# EAGLE design sanguino_better (EAGLE 5.10)
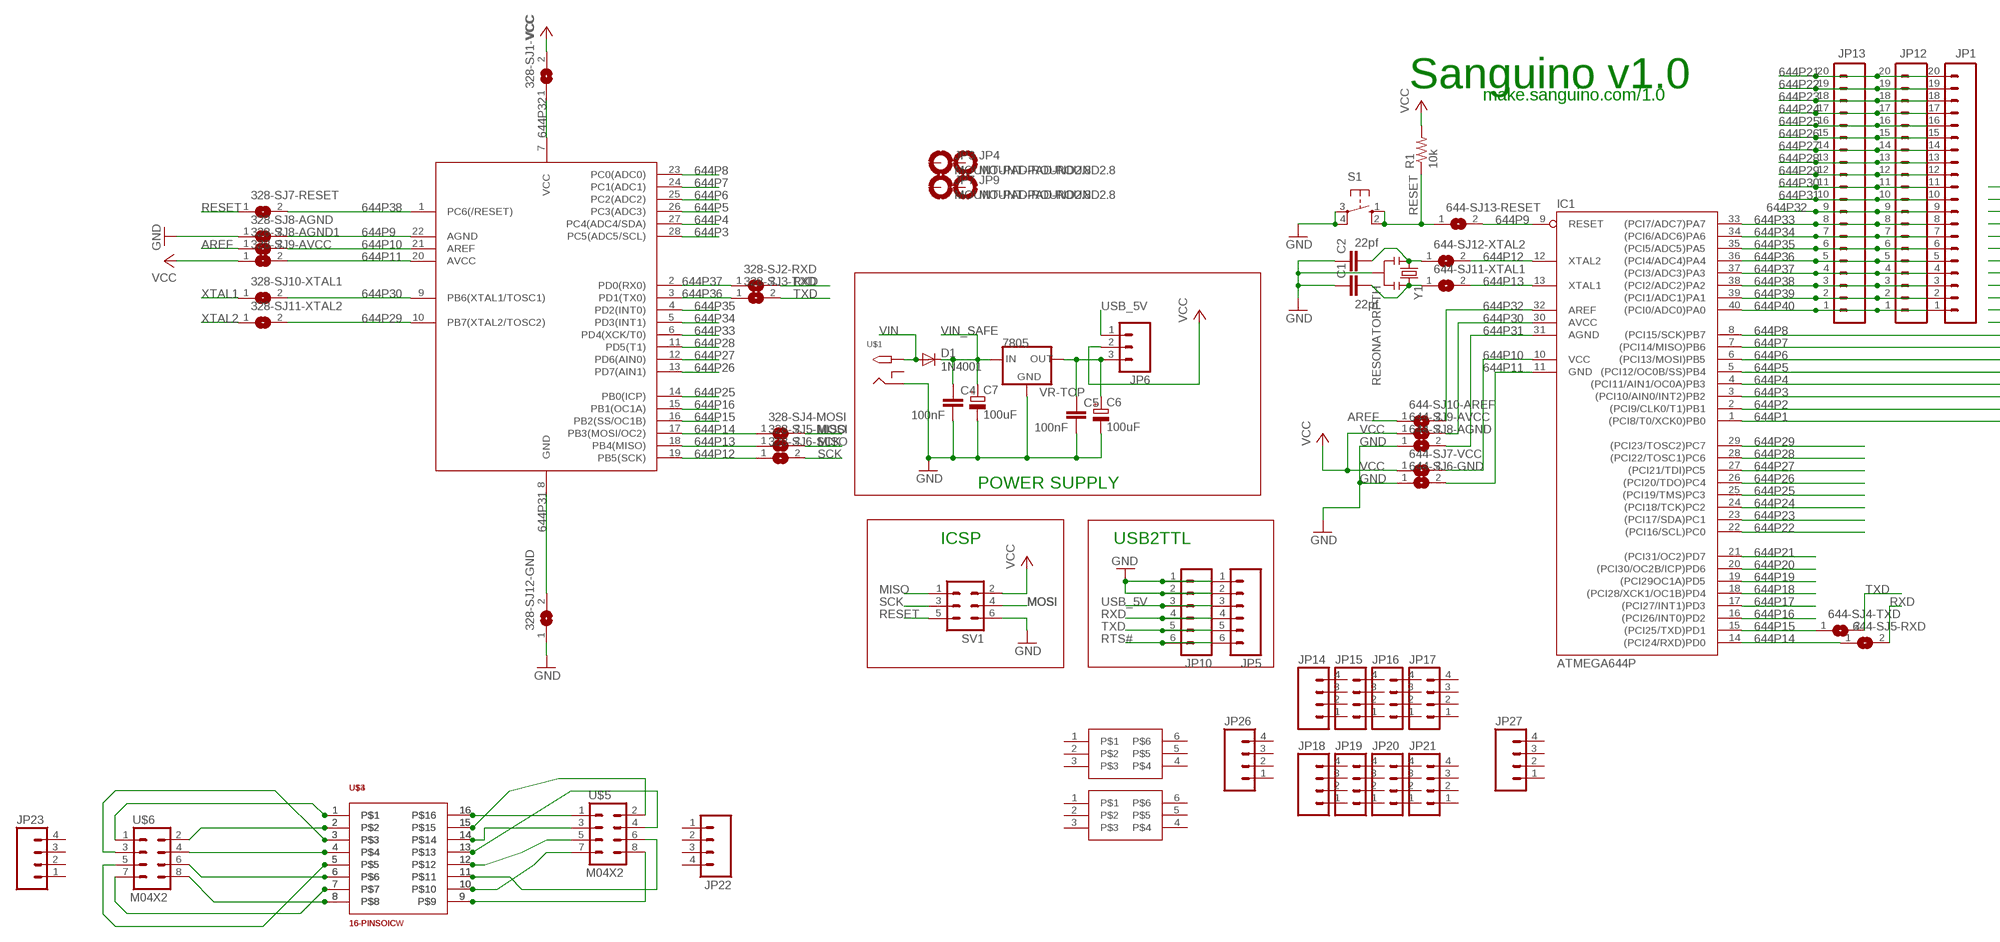
[diagram p0: schematic, sheet 1, part 1 of 2]
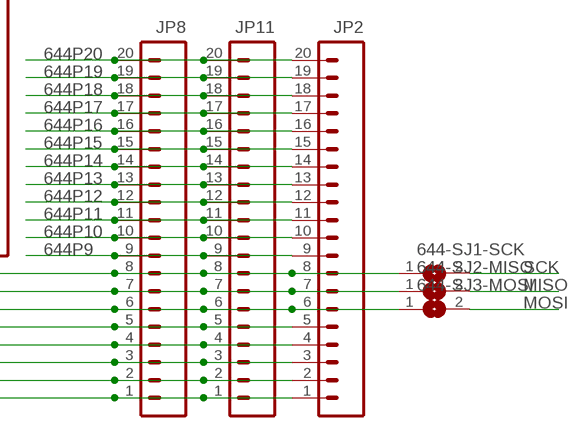
[diagram p1: schematic, sheet 1, part 2 of 2]

## Parts
328-SJ1-VCC  SJ  [SJ]
328-SJ2-RXD  SJ  [SJ]
328-SJ3-TXD  SJ  [SJ]
328-SJ4-MOSI  SJ  [SJ]
328-SJ5-MISO  SJ  [SJ]
328-SJ6-SCK  SJ  [SJ]
328-SJ7-RESET  SJ  [SJ]
328-SJ8-AGND  SJ  [SJ]
328-SJ8-AGND1  SJ  [SJ]
328-SJ9-AVCC  SJ  [SJ]
328-SJ10-XTAL1  SJ  [SJ]
328-SJ11-XTAL2  SJ  [SJ]
328-SJ12-GND  SJ  [SJ]
644-SJ1-SCK  SJ  [SJ]
644-SJ2-MISO  SJ  [SJ]
644-SJ3-MOSI  SJ  [SJ]
644-SJ4-TXD  SJ  [SJ]
644-SJ5-RXD  SJ  [SJ]
644-SJ6-GND  SJ  [SJ]
644-SJ7-VCC  SJ  [SJ]
644-SJ8-AGND  SJ  [SJ]
644-SJ9-AVCC  SJ  [SJ]
644-SJ10-AREF  SJ  [SJ]
644-SJ11-XTAL1  SJ  [SJ]
644-SJ12-XTAL2  SJ  [SJ]
644-SJ13-RESET  SJ  [SJ]
C1  22pf  C-EU025-025X050  [C025-025X050]
C2  22pf  C-EU025-025X050  [C025-025X050]
C4  100nF  C-EU050-030X075  [C050-030X075]
C5  100nF  C-EU050-030X075  [C050-030X075]
C6  100uF  CPOL-EUE2.5-6  [E2,5-6]
C7  100uF  CPOL-EUE2.5-6  [E2,5-6]
D1  1N4001  1N4004  [DO41-10]
IC1  ATMEGA644P  ATMEGA644V-10P  [DIL40]
JP1  M20  [1X20]
JP2  M20  [1X20]
JP3  MOUNT-PAD-ROUND2.8  [2,8-PAD]
JP4  MOUNT-PAD-ROUND2.8  [2,8-PAD]
JP5  M06LOCK  [1X06_LOCK]
JP6  M03PTH  [1X03]
JP7  MOUNT-PAD-ROUND2.8  [2,8-PAD]
JP8  M20  [1X20]
JP9  MOUNT-PAD-ROUND2.8  [2,8-PAD]
JP10  M06SIP  [1X06]
JP11  M20  [1X20]
JP12  M20  [1X20]
JP13  M20  [1X20]
JP14  M04PTH  [1X04]
JP15  M04PTH  [1X04]
JP16  M04PTH  [1X04]
JP17  M04PTH  [1X04]
JP18  M04PTH  [1X04]
JP19  M04PTH  [1X04]
JP20  M04PTH  [1X04]
JP21  M04PTH  [1X04]
JP22  M04PTH  [1X04]
JP23  M04PTH  [1X04]
JP26  M04PTH  [1X04]
JP27  M04PTH  [1X04]
R1  10k  R-US_0207/2V  [0207/2V]
S1  10-XX  [B3F-10XX]
SV1  ML6  [ML6]
U$1  2.1MMJACKTHM  [PJ-102A-DOUBLE_SIDED]
U$2  ATMEGA328P  [DIL28-3]
U$3  16-PINSOICW  [SO16W]
U$4  16-PINSOIC  [SO16]
U$5  M04X2  [2X4]
U$6  M04X2  [2X4]
U$7  6-PINSOT23-6  [SOT23-6L]
U$8  6-PINSC70-6  [SC70-6L]
VR-TOP  7805  V_REG_78XXSINK  [TO220-IGO]
Y1  RESONATORPTH  [RESONATOR-PTH]

## Nets
644P1: IC1.1((PCI8/T0/XCK0)PB0) JP2.1 JP8.1 JP11.1
644P2: IC1.2((PCI9/CLK0/T1)PB1) JP2.2 JP8.2 JP11.2
644P3: IC1.3((PCI10/AIN0/INT2)PB2) JP2.3 JP8.3 JP11.3 U$2.28(PC5(ADC5/SCL))
644P4: IC1.4((PCI11/AIN1/OC0A)PB3) JP2.4 JP8.4 JP11.4 U$2.27(PC4(ADC4/SDA))
644P5: IC1.5((PCI12/OC0B/SS)PB4) JP2.5 JP8.5 JP11.5 U$2.26(PC3(ADC3))
644P6: 644-SJ3-MOSI.1 IC1.6((PCI13/MOSI)PB5) JP2.6 JP8.6 JP11.6 U$2.25(PC2(ADC2))
644P7: 644-SJ2-MISO.1 IC1.7((PCI14/MISO)PB6) JP2.7 JP8.7 JP11.7 U$2.24(PC1(ADC1))
644P8: 644-SJ1-SCK.1 IC1.8((PCI15/SCK)PB7) JP2.8 JP8.8 JP11.8 U$2.23(PC0(ADC0))
644P9: 328-SJ8-AGND.2 644-SJ13-RESET.2 IC1.9(RESET) JP2.9 JP8.9 JP11.9 U$2.22(AGND)
644P10: 328-SJ8-AGND1.2 644-SJ7-VCC.2 IC1.10(VCC) JP2.10 JP8.10 JP11.10 U$2.21(AREF)
644P11 [power]: 328-SJ9-AVCC.2 644-SJ6-GND.2 IC1.11(GND) JP2.11 JP8.11 JP11.11 U$2.20(AVCC)
644P12: 328-SJ6-SCK.1 644-SJ12-XTAL2.2 IC1.12(XTAL2) JP2.12 JP8.12 JP11.12 U$2.19(PB5(SCK))
644P13: 328-SJ5-MISO.1 644-SJ11-XTAL1.2 IC1.13(XTAL1) JP2.13 JP8.13 JP11.13 U$2.18(PB4(MISO))
644P14: 328-SJ4-MOSI.1 644-SJ5-RXD.1 IC1.14((PCI24/RXD)PD0) JP2.14 JP8.14 JP11.14 U$2.17(PB3(MOSI/OC2))
644P15: 644-SJ4-TXD.1 IC1.15((PCI25/TXD)PD1) JP2.15 JP8.15 JP11.15 U$2.16(PB2(SS/OC1B))
644P16: IC1.16((PCI26/INT0)PD2) JP2.16 JP8.16 JP11.16 U$2.15(PB1(OC1A))
644P17: IC1.17((PCI27/INT1)PD3) JP2.17 JP8.17 JP11.17
644P18: IC1.18((PCI28/XCK1/OC1B)PD4) JP2.18 JP8.18 JP11.18
644P19: IC1.19((PCI29OC1A)PD5) JP2.19 JP8.19 JP11.19
644P20: IC1.20((PCI30/OC2B/ICP)PD6) JP2.20 JP8.20 JP11.20
644P21: IC1.21((PCI31/OC2)PD7) JP1.20 JP12.20 JP13.20
644P22: IC1.22((PCI16/SCL)PC0) JP1.19 JP12.19 JP13.19
644P23: IC1.23((PCI17/SDA)PC1) JP1.18 JP12.18 JP13.18
644P24: IC1.24((PCI18/TCK)PC2) JP1.17 JP12.17 JP13.17
644P25: IC1.25((PCI19/TMS)PC3) JP1.16 JP12.16 JP13.16 U$2.14(PB0(ICP))
644P26: IC1.26((PCI20/TDO)PC4) JP1.15 JP12.15 JP13.15 U$2.13(PD7(AIN1))
644P27: IC1.27((PCI21/TDI)PC5) JP1.14 JP12.14 JP13.14 U$2.12(PD6(AIN0))
644P28: IC1.28((PCI22/TOSC1)PC6) JP1.13 JP12.13 JP13.13 U$2.11(PD5(T1))
644P29: 328-SJ11-XTAL2.2 IC1.29((PCI23/TOSC2)PC7) JP1.12 JP12.12 JP13.12 U$2.10(PB7(XTAL2/TOSC2))
644P30: 328-SJ10-XTAL1.2 644-SJ9-AVCC.2 IC1.30(AVCC) JP1.11 JP12.11 JP13.11 U$2.9(PB6(XTAL1/TOSC1))
644P31: 328-SJ12-GND.2 644-SJ8-AGND.2 IC1.31(AGND) JP1.10 JP12.10 JP13.10 U$2.8(GND)
644P32: 328-SJ1-VCC.1 644-SJ10-AREF.2 IC1.32(AREF) JP1.9 JP12.9 JP13.9 U$2.7(VCC)
644P33: IC1.33((PCI7/ADC7)PA7) JP1.8 JP12.8 JP13.8 U$2.6(PD4(XCK/T0))
644P34: IC1.34((PCI6/ADC6)PA6) JP1.7 JP12.7 JP13.7 U$2.5(PD3(INT1))
644P35: IC1.35((PCI5/ADC5)PA5) JP1.6 JP12.6 JP13.6 U$2.4(PD2(INT0))
644P36: 328-SJ3-TXD.1 IC1.36((PCI4/ADC4)PA4) JP1.5 JP12.5 JP13.5 U$2.3(PD1(TX0))
644P37: 328-SJ2-RXD.1 IC1.37((PCI3/ADC3)PA3) JP1.4 JP12.4 JP13.4 U$2.2(PD0(RX0))
644P38: 328-SJ7-RESET.2 IC1.38((PCI2/ADC2)PA2) JP1.3 JP12.3 JP13.3 U$2.1(PC6(/RESET))
644P39: IC1.39((PCI1/ADC1)PA1) JP1.2 JP12.2 JP13.2
644P40: IC1.40((PCI0/ADC0)PA0) JP1.1 JP12.1 JP13.1
AREF: 328-SJ8-AGND1.1 644-SJ10-AREF.1
GND: 328-SJ8-AGND.1 328-SJ12-GND.1 644-SJ6-GND.1 644-SJ8-AGND.1 C1.1 C2.1 C4.2 C5.2 C6.- C7.- JP5.1 JP5.2 JP10.1 JP10.2 S1.3(P) S1.4(P1) SV1.6 U$1.RING VR-TOP.GND Y1.2
MISO: 328-SJ5-MISO.2 644-SJ2-MISO.2 SV1.1
MOSI: 328-SJ4-MOSI.2 644-SJ3-MOSI.2 SV1.4
N$11: U$3.16 U$4.16 U$5.1
N$12: U$3.15 U$4.15 U$5.2
N$14: U$3.5 U$4.5 U$6.5
N$15: U$3.1 U$4.1 U$6.1
N$21: U$3.14 U$4.14 U$5.3
N$22: U$3.13 U$4.13 U$5.4
N$23: U$3.12 U$4.12 U$5.5
N$24: U$3.11 U$4.11 U$5.6
N$25: U$3.10 U$4.10 U$5.7
N$26: U$3.9 U$4.9 U$5.8
N$27: U$3.8 U$4.8 U$6.8
N$28: U$3.7 U$4.7 U$6.7
N$29: U$3.6 U$4.6 U$6.6
N$31: U$3.4 U$4.4 U$6.4
N$32: U$3.3 U$4.3 U$6.3
N$33: U$3.2 U$4.2 U$6.2
RESET: 328-SJ7-RESET.1 644-SJ13-RESET.1 R1.1 S1.1(S) S1.2(S1) SV1.5
RTS#: JP5.6 JP10.6
RXD: 328-SJ2-RXD.2 644-SJ5-RXD.2 JP5.4 JP10.4
SCK: 328-SJ6-SCK.2 644-SJ1-SCK.2 SV1.3
TXD: 328-SJ3-TXD.2 644-SJ4-TXD.2 JP5.5 JP10.5
USB_5V: JP5.3 JP6.1 JP10.3
VCC [power]: 328-SJ1-VCC.2 328-SJ9-AVCC.1 644-SJ7-VCC.1 644-SJ9-AVCC.1 JP6.2 R1.2 SV1.2
VIN [power]: D1.A U$1.TIP
VIN_SAFE [power]: C4.1 C7.+ D1.C VR-TOP.IN
VREG-OUT: C5.1 C6.+ JP6.3 VR-TOP.OUT
XTAL1: 328-SJ10-XTAL1.1 644-SJ11-XTAL1.1 C1.2 Y1.3
XTAL2: 328-SJ11-XTAL2.1 644-SJ12-XTAL2.1 C2.2 Y1.1
Unconnected: JP3.B2,8(MOUNT) JP4.B2,8(MOUNT) JP7.B2,8(MOUNT) JP9.B2,8(MOUNT) JP14.1 JP14.2 JP14.3 JP14.4 JP15.1 JP15.2 JP15.3 JP15.4 JP16.1 JP16.2 JP16.3 JP16.4 JP17.1 JP17.2 JP17.3 JP17.4 JP18.1 JP18.2 JP18.3 JP18.4 JP19.1 JP19.2 JP19.3 JP19.4 JP20.1 JP20.2 JP20.3 JP20.4 JP21.1 JP21.2 JP21.3 JP21.4 JP22.1 JP22.2 JP22.3 JP22.4 JP23.1 JP23.2 JP23.3 JP23.4 JP26.1 JP26.2 JP26.3 JP26.4 JP27.1 JP27.2 JP27.3 JP27.4 U$1.RING_SW U$7.1 U$7.2 U$7.3 U$7.4 U$7.5 U$7.6 U$8.1 U$8.2 U$8.3 U$8.4 U$8.5 U$8.6

## Notes on the sheet
- Sanguino v1.0
- make.sanguino.com/1.0
- POWER SUPPLY
- ICSP | USB2TTL

## Library data of the parts
328-SJ1-VCC 328-SJ2-RXD 328-SJ3-TXD 328-SJ4-MOSI 328-SJ5-MISO 328-SJ6-SCK 328-SJ7-RESET 328-SJ8-AGND 328-SJ8-AGND1 328-SJ9-AVCC 328-SJ10-XTAL1 328-SJ11-XTAL2 328-SJ12-GND 644-SJ1-SCK 644-SJ2-MISO 644-SJ3-MOSI 644-SJ4-TXD 644-SJ5-RXD 644-SJ6-GND 644-SJ7-VCC 644-SJ8-AGND 644-SJ9-AVCC 644-SJ10-AREF 644-SJ11-XTAL1 644-SJ12-XTAL2 644-SJ13-RESET = ideabot:SJ: SMD solder JUMPER
C1 C2 C4 C5 = rcl:C-EU: CAPACITOR, European symbol
C6 C7 = rcl:CPOL-EU: POLARIZED CAPACITOR, European symbol
D1 = diode:1N4004: DIODE general purpose rectifier, 1 A
IC1 = avr:ATMEGA644*P: MICROCONTROLLER 64 kBytes FLASH 4 kBytes SRAM 2 kBytes EEPROM DUAL USART 8-channel 10 bit ADC
JP1 JP2 JP8 JP11-JP13 = SparkFun:M20: This is just like the LOCK variant in that the holes are staggared by 5 mil, but except for the last two holes. They are not altered from the "standard" footprint layout. This is used for a special purpose on the layout of our Graphic LCD Backpack. Make sure you want to use this device before selecting it for you project!
JP3 JP4 JP7 JP9 = holes:MOUNT-PAD-ROUND: MOUNTING PAD, round
JP5 JP10 = SparkFun:M06: Header 6 Standard 6-pin 0.1" header. Use with straight break away headers (SKU : PRT-00116), right angle break away headers (PRT-00553), swiss pins (PRT-00743), machine pins (PRT-00117), and female headers (PRT-00115). Molex polarized connector foot print use with SKU : PRT-08094 with associated crimp pins and housings. NOTES ON THE VARIANTS LOCK and LOCK_LONGPADS... This footprint was designed to help hold the alignment of a through-hole component (i.e. 6-pin header) while soldering it into place. You may notice that each hole has been shifted either up or down by 0.005 of an inch from it's more standard position (which is a perfectly straight line). This slight alteration caused the pins (the squares in the middle) to touch the edges of the holes. Because they are alternating, it causes a "brace" to hold the component in place. 0.005 has proven to be the perfect amount of "off-center" position when using our standard breakaway headers. Although looks a little odd when you look at the bare footprint, once you have a header in there, the alteration is very hard to notice. Also, if you push a header all the way into place, it is covered up entirely on the bottom side. This idea of altering the position of holes to aid alignment will be further integrated into the Sparkfun Library for other footprints. It can help hold any component with 3 or more connection pins.
JP6 = SparkFun:M03: Header 3 Standard 3-pin 0.1" header. Use with straight break away headers (SKU : PRT-00116), right angle break away headers (PRT-00553), swiss pins (PRT-00743), machine pins (PRT-00117), and female headers (PRT-00115). Molex polarized connector foot print use with SKU : PRT-08232 with associated crimp pins and housings.
JP14-JP23 JP26 JP27 = SparkFun:M04: Header 4 Standard 4-pin 0.1" header. Use with straight break away headers (SKU : PRT-00116), right angle break away headers (PRT-00553), swiss pins (PRT-00743), machine pins (PRT-00117), and female headers (PRT-00115). Molex polarized connector foot print use with SKU : PRT-08231 with associated crimp pins and housings. 1MM SMD Version SKU: PRT-10208
R1 = adafruit:R-US_: RESISTOR, American symbol
S1 = switch-omron:10-XX: OMRON SWITCH
SV1 = con-harting-ml:ML6: HARTING
U$1 = ideabot:2.1MMJACK: 2.1mm x 5.5mm THM DC jack with internal switch. Digikey part #PJ-102A, 4UCON part #05537 2.1mm x 5.5mm SMT DC jack with internal switch. Digikey part #PJ-002A-SMT, 4UCON part #03267 By microbuilder.eu & adafruit.com
U$2 = ideabot:ATMEGA328P
U$3 U$4 = ideabot:16-PIN
U$5 U$6 = SparkFun:M04X2
U$7 U$8 = ideabot:6-PIN
VR-TOP = SparkFun:V_REG_78XX: Voltage Regulator Standard 7805 5V regulator. IGO (Input Ground Output). Spark Fun Electronics SKU : COM-00107
Y1 = SparkFun:RESONATOR: Resonator Small SMD resonator. This is the itty bitty 10/20MHz resonators with built in caps. CSTCE10M0G55 and CSTCE20M0V53. Footprint has been reviewed closely but hasn't been tested yet.

## Net classes
0 default: width 0.254 mm, clearance 0.152 mm
1 power: width 0.305 mm, clearance 0.152 mm

## Board
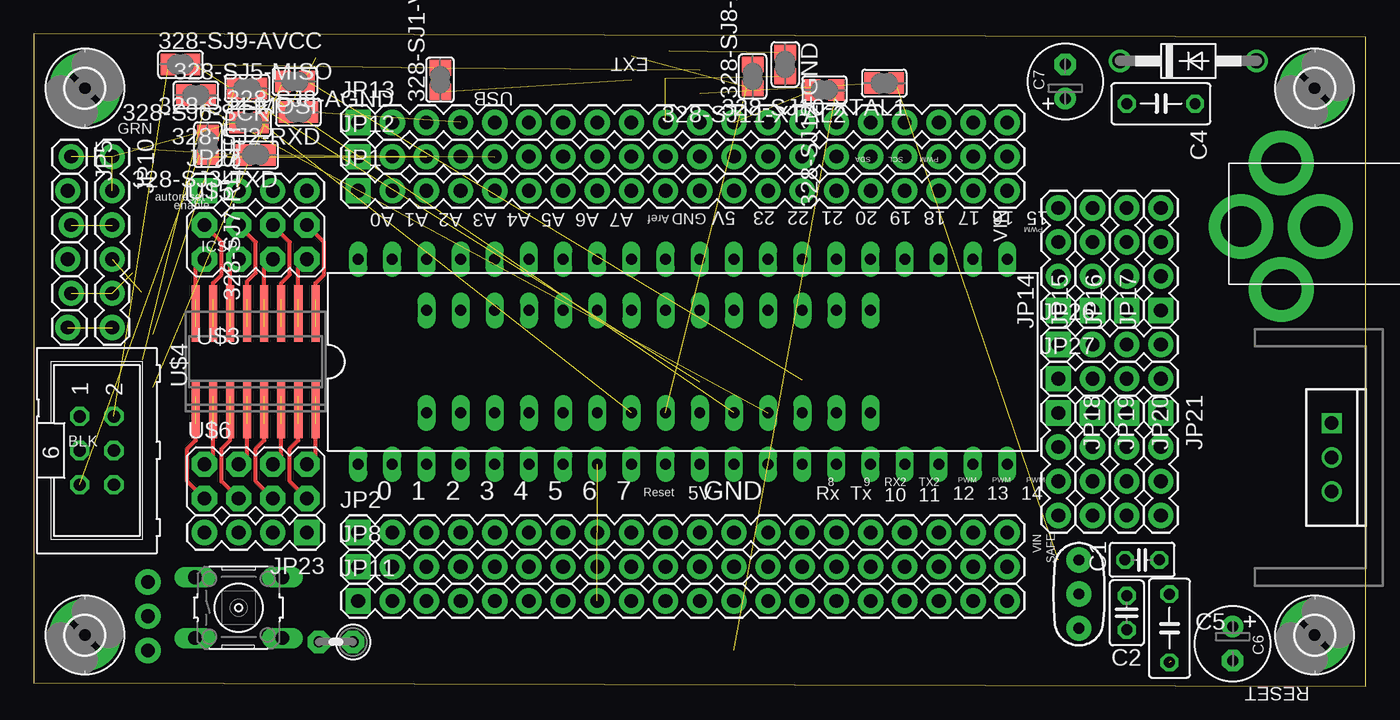
[diagram p2: board, top side]
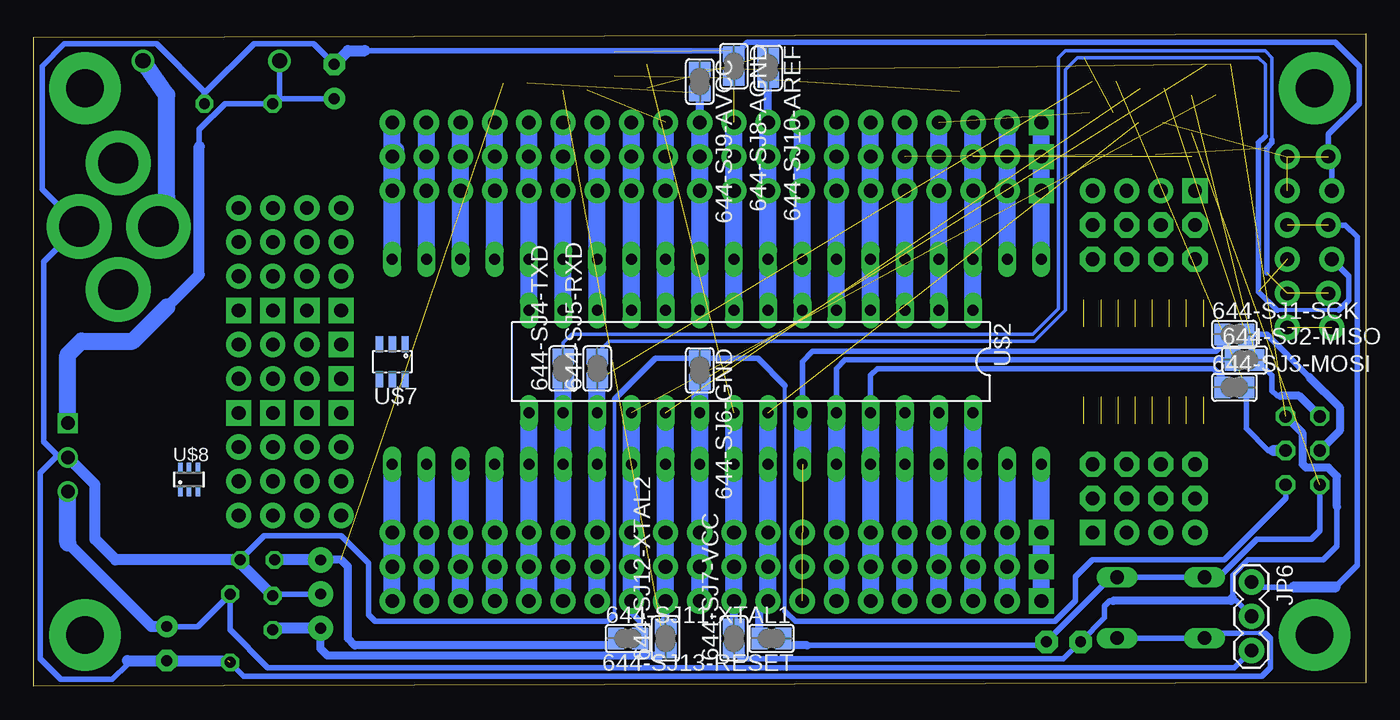
[diagram p3: board, bottom side, seen from below]

Size 99.06 x 48.51 mm. Coordinates in mm from the lower left corner, seen from the top.
Outline: 0,0.25 99.06,0 99.06,48.26 0,48.51 0,0.25
Copper layers (1*16): Top 0.035mm / dielectric 1.5mm / Bottom 0.035mm
Design rules "Fusion_eagle_rule_v1.1 *": minimum track width 6mil, minimum drill 12mil, track to track 6mil, track to pad 6mil, pad to pad 6mil, via to via 6mil, smd to smd 0mil, copper to edge 10mil, drill to drill 10mil, minimum pad ring 10mil, minimum via ring 6mil, stop-mask expansion 2mil, vias tented up to drill 100mil, thermal gap 10mil

### Footprints (pad centres in the part's own frame; a part is rotated, then mirrored left to right if it is on the bottom)
SJ = smd 1.168 x 1.6: 1 -0.889,0; 2 0.889,0
C025-025X050 = drill 0.813 octagon: 1 -1.27,0; 2 1.27,0
C050-030X075 = drill 0.813 octagon: 1 -2.54,0; 2 2.54,0
E2,5-6 = drill 0.813 pad 1.6 round: + -1.27,0 | drill 0.813 pad 1.6 octagon: - 1.27,0
DO41-10 = drill 1.118 round: A 5.08,0; C -5.08,0
DIL40 = drill 0.813 long: 1 -24.13,-7.62; 2 -21.59,-7.62; 3 -19.05,-7.62; 4 -16.51,-7.62; 5 -13.97,-7.62; 6 -11.43,-7.62; 7 -8.89,-7.62; 8 -6.35,-7.62; 9 -3.81,-7.62; 10 -1.27,-7.62; 11 1.27,-7.62; 12 3.81,-7.62; 13 6.35,-7.62; 14 8.89,-7.62; 15 11.43,-7.62; 16 13.97,-7.62; 17 16.51,-7.62; 18 19.05,-7.62; 19 21.59,-7.62; 20 24.13,-7.62; 21 24.13,7.62; 22 21.59,7.62; 23 19.05,7.62; 24 16.51,7.62; 25 13.97,7.62; 26 11.43,7.62; 27 8.89,7.62; 28 6.35,7.62; 29 3.81,7.62; 30 1.27,7.62; 31 -1.27,7.62; 32 -3.81,7.62; 33 -6.35,7.62; 34 -8.89,7.62; 35 -11.43,7.62; 36 -13.97,7.62; 37 -16.51,7.62; 38 -19.05,7.62; 39 -21.59,7.62; 40 -24.13,7.62
1X20 = drill 1.016 pad 1.88 square: 1 0,0 | drill 1.016 pad 1.88 round: 2 2.54,0; 3 5.08,0; 4 7.62,0; 5 10.16,0; 6 12.7,0; 7 15.24,0; 8 17.78,0; 9 20.32,0; 10 22.86,0; 11 25.4,0; 12 27.94,0; 13 30.48,0; 14 33.02,0; 15 35.56,0; 16 38.1,0; 17 40.64,0; 18 43.18,0; 19 45.72,0; 20 48.26,0
2,8-PAD = drill 2.8 pad 5.334 round: B2,8 0,0
1X06_LOCK = drill 1.016 pad 1.88 round: 1 0,0; 2 2.54,-0.254; 3 5.08,0; 4 7.62,-0.254; 5 10.16,0; 6 12.7,-0.254
1X03 = drill 1.016 pad 1.88 round: 1 0,0; 2 2.54,0; 3 5.08,0
1X06 = drill 1.016 pad 1.88 round: 1 0,0; 2 2.54,0; 3 5.08,0; 4 7.62,0; 5 10.16,0; 6 12.7,0
1X04 = drill 1.016 pad 1.88 square: 1 0,0 | drill 1.016 pad 1.88 round: 2 2.54,0; 3 5.08,0; 4 7.62,0
0207/2V = drill 0.813 pad 1.676 octagon: 1 -1.27,0; 2 1.27,0
B3F-10XX = drill 1.016 long: 1 -3.251,2.261; 2 3.251,2.261; 3 -3.251,-2.261; 4 3.251,-2.261
ML6 = drill 0.914 octagon: 1 -2.54,-1.27; 2 -2.54,1.27; 3 0,-1.27; 4 0,1.27; 5 2.54,-1.27; 6 2.54,1.27
PJ-102A-DOUBLE_SIDED = drill 3 pad 4.8 round: RING 0.1,-3.39; RING_SW -4.6,-6.29; RING_SW1 4.8,-6.29; TIP 0.1,-9.29
DIL28-3 = drill 0.813 long: 1 -16.51,-3.81; 2 -13.97,-3.81; 3 -11.43,-3.81; 4 -8.89,-3.81; 5 -6.35,-3.81; 6 -3.81,-3.81; 7 -1.27,-3.81; 8 1.27,-3.81; 9 3.81,-3.81; 10 6.35,-3.81; 11 8.89,-3.81; 12 11.43,-3.81; 13 13.97,-3.81; 14 16.51,-3.81; 15 16.51,3.81; 16 13.97,3.81; 17 11.43,3.81; 18 8.89,3.81; 19 6.35,3.81; 20 3.81,3.81; 21 1.27,3.81; 22 -1.27,3.81; 23 -3.81,3.81; 24 -6.35,3.81; 25 -8.89,3.81; 26 -11.43,3.81; 27 -13.97,3.81; 28 -16.51,3.81
SO16W = smd 0.6 x 2.2: 1 -4.445,-4.6; 2 -3.175,-4.6; 3 -1.905,-4.6; 4 -0.635,-4.6; 5 0.635,-4.6; 6 1.905,-4.6; 7 3.175,-4.6; 8 4.445,-4.6; 9 4.445,4.6; 10 3.175,4.6; 11 1.905,4.6; 12 0.635,4.6; 13 -0.635,4.6; 14 -1.905,4.6; 15 -3.175,4.6; 16 -4.445,4.6
SO16 = smd 0.6 x 2.2: 1 -4.445,-2.6; 2 -3.175,-2.6; 3 -1.905,-2.6; 4 -0.635,-2.6; 5 0.635,-2.6; 6 1.905,-2.6; 7 3.175,-2.6; 8 4.445,-2.6; 9 4.445,2.6; 10 3.175,2.6; 11 1.905,2.6; 12 0.635,2.6; 13 -0.635,2.6; 14 -1.905,2.6; 15 -3.175,2.6; 16 -4.445,2.6
2X4 = drill 1.016 pad 1.88 octagon: 1 -3.81,-1.27; 2 -3.81,1.27; 3 -1.27,-1.27; 4 -1.27,1.27; 5 1.27,-1.27; 6 1.27,1.27; 7 3.81,-1.27; 8 3.81,1.27
SOT23-6L = smd 0.55 x 1.2: 1 -0.95,-1.3; 2 0,-1.3; 3 0.95,-1.3; 4 0.95,1.3; 5 0,1.3; 6 -0.95,1.3
SC70-6L = smd 0.35 x 0.8: 1 -0.65,-0.85; 2 0,-0.85; 3 0.65,-0.85; 4 0.65,0.85; 5 0,0.85; 6 -0.65,0.85
TO220-IGO = drill 1 round: GND 0,0; OUT 2.54,0 | drill 1 square: IN -2.54,0
RESONATOR-PTH = drill 0.8 pad 1.88 round: 1 -2.54,0; 2 0,0; 3 2.54,0

### Placement (x,y rotation side)
328-SJ1-VCC  30.23,45.09 90 top
328-SJ2-RXD  19.68,42.67 180 top
328-SJ3-TXD  16.51,39.5 180 top
328-SJ4-MOSI  19.43,44.96 180 top
328-SJ5-MISO  12.06,43.94 0 top
328-SJ6-SCK  15.88,44.45 180 top
328-SJ7-RESET  12.95,40.26 270 top
328-SJ8-AGND  16,41.91 0 top
328-SJ8-AGND1  53.47,45.34 90 top
328-SJ9-AVCC  10.92,46.23 0 top
328-SJ10-XTAL1  63.25,44.83 180 top
328-SJ11-XTAL2  58.8,44.32 180 top
328-SJ12-GND  55.88,46.23 270 top
644-SJ1-SCK  9.78,26.16 0 bottom
644-SJ2-MISO  9.02,24.26 0 bottom
644-SJ3-MOSI  9.78,22.23 0 bottom
644-SJ4-TXD  59.69,23.62 90 bottom
644-SJ5-RXD  57.15,23.62 90 bottom
644-SJ6-GND  49.53,23.5 270 bottom
644-SJ7-VCC  46.99,3.56 90 bottom
644-SJ8-AGND  46.99,46.1 270 bottom
644-SJ9-AVCC  49.53,44.96 270 bottom
644-SJ10-AREF  44.45,45.97 270 bottom
644-SJ11-XTAL1  54.86,3.56 0 bottom
644-SJ12-XTAL2  52.07,3.56 90 bottom
644-SJ13-RESET  44.2,3.56 180 bottom
C1  82.42,9.4 180 top
C2  81.28,5.46 270 top
C4  83.82,43.31 0 top
C5  84.45,4.32 270 top
C6  89.15,3.17 270 top
C7  76.71,44.96 90 top
D1  85.85,46.48 0 top
IC1  48.26,24.13 0 top
JP1  24.13,36.83 0 top
JP2  24.13,11.43 0 top
JP3  3.81,3.81 0 top
JP4  95.25,3.81 0 top
JP5  2.79,39.37 270 top
JP6  8.51,7.75 270 bottom
JP7  3.81,44.45 0 top
JP8  24.13,8.89 0 top
JP9  95.25,44.45 0 top
JP10  5.84,39.37 270 top
JP11  24.13,6.35 0 top
JP12  24.13,39.37 0 top
JP13  24.13,41.91 0 top
JP14  76.2,27.94 90 top
JP15  78.74,27.94 90 top
JP16  81.28,27.94 90 top
JP17  83.82,27.94 90 top
JP18  76.2,20.32 270 top
JP19  78.74,20.32 270 top
JP20  81.28,20.32 270 top
JP21  83.82,20.32 270 top
JP22  12.7,36.83 0 top
JP23  20.32,11.43 180 top
JP26  76.2,25.4 0 top
JP27  76.2,22.86 0 top
R1  22.48,3.3 180 top
S1  15.24,5.84 0 top
SV1  4.7,17.53 270 top
U$1  99.06,34.29 270 top
U$2  45.72,24.13 180 bottom
U$3  16.51,24.13 0 top
U$4  16.51,24.13 0 top
U$5  16.51,33.02 0 top
U$6  16.51,15.24 0 top
U$7  72.39,24.13 180 bottom
U$8  87.5,15.37 0 bottom
VR-TOP  96.52,17.02 270 top
Y1  77.72,6.86 90 top

### Tracks (layer width: path | path; a pad name or v marks a point on that pad's centre or on a via)
644P1
  Bottom 1.27: JP11.1 JP8.1 JP2.1 IC1.1
644P2
  Bottom 1.27: IC1.2 JP2.2 JP8.2 JP11.2
644P3
  Bottom 1.27: U$2.28 IC1.3 JP2.3 JP8.3 JP11.3
644P4
  Bottom 1.27: U$2.27 IC1.4 JP2.4 JP8.4 JP11.4
644P5
  Bottom 1.27: U$2.26 IC1.5 JP2.5 JP8.5 JP11.5
644P6
  Bottom 0.406: U$2.25 36.83,23.11 36.32,23.62 11.3,23.62 10.67,22.99 644-SJ3-MOSI.1
  Bottom 1.27: U$2.25 IC1.6 JP2.6 JP8.6 JP11.6
644P7
  Bottom 0.406: U$2.24 39.37,23.62 38.73,24.26 644-SJ2-MISO.1
  Bottom 1.27: U$2.24 IC1.7 JP2.7 JP8.7 JP11.7
644P8  (3 unrouted)
  Bottom 0.406: U$2.23 41.91,24.13 41.15,24.89 11.18,24.89 10.67,25.4 644-SJ1-SCK.1
  Bottom 1.27: U$2.23 IC1.8
644P9  (1 unrouted)
  Bottom 0.61: 644-SJ13-RESET.2 45.09,5.71 JP11.9
  Bottom 1.27: U$2.22 IC1.9 JP2.9 JP8.9 JP11.9
644P10  (1 unrouted)
  Bottom 0.61: 644-SJ7-VCC.2 JP11.10
  Bottom 1.27: U$2.21 IC1.10 JP2.10 JP8.10 JP11.10
644P11  (1 unrouted)
  Bottom 1.27: 644-SJ6-GND.2 U$2.20 IC1.11 JP2.11 JP8.11 JP11.11
644P12  (1 unrouted)
  Bottom 0.61: 644-SJ12-XTAL2.2 JP11.12
  Bottom 1.27: U$2.19 IC1.12 JP2.12 JP8.12 JP11.12
644P13  (1 unrouted)
  Bottom 0.406: 54.61,6.22 54.61,5.46 53.98,4.83 644-SJ11-XTAL1.2
  Bottom 0.61: 54.61,6.22 JP11.13
  Bottom 1.27: U$2.18 IC1.13 JP2.13 JP8.13 JP11.13
644P14  (1 unrouted)
  Bottom 1.27: 644-SJ5-RXD.1 U$2.17 IC1.14 JP2.14 JP8.14 JP11.14
644P15
  Bottom 1.27: 644-SJ4-TXD.1 U$2.16 IC1.15 JP2.15 JP8.15 JP11.15
644P16
  Bottom 1.27: U$2.15 IC1.16 JP2.16 JP8.16 JP11.16
644P17
  Bottom 1.27: IC1.17 JP2.17 JP8.17 JP11.17
644P18
  Bottom 1.27: IC1.18 JP2.18 JP8.18 JP11.18
644P19
  Bottom 1.27: IC1.19 JP2.19 JP8.19 JP11.19
644P20
  Bottom 1.27: IC1.20 JP2.20 JP8.20 JP11.20
644P21
  Bottom 1.27: IC1.21 JP1.20 JP12.20 | JP12.20 72.39,39.62 72.14,39.88 72.14,39.62 JP12.20 | JP12.20 JP13.20
644P22
  Bottom 1.27: IC1.22 JP1.19 JP12.19 JP13.19
644P23
  Bottom 1.27: IC1.23 JP1.18 JP12.18 JP13.18
644P24
  Bottom 1.27: IC1.24 JP1.17 JP12.17 JP13.17
644P25
  Bottom 1.27: U$2.14 IC1.25 JP1.16 JP12.16 JP13.16
644P26
  Bottom 1.27: U$2.13 IC1.26 JP1.15 JP12.15 JP13.15
644P27
  Bottom 1.27: U$2.12 IC1.27 JP1.14 JP12.14 JP13.14
644P28
  Bottom 1.27: U$2.11 IC1.28 JP1.13 JP12.13 JP13.13
644P29  (1 unrouted)
  Bottom 1.27: U$2.10 IC1.29 JP1.12 JP12.12 JP13.12
644P30  (1 unrouted)
  Bottom 0.305: 49.53,32.38 49.53,32.51
  Bottom 0.61: JP13.11 644-SJ9-AVCC.2
  Bottom 1.27: 49.53,32.51 JP1.11 JP12.11 JP13.11 | 49.53,32.38 IC1.30 U$2.9
644P31  (2 unrouted)
  Bottom 1.27: U$2.8 IC1.31 JP1.10 JP12.10 JP13.10
644P32  (1 unrouted)
  Bottom 0.61: JP13.9 644-SJ10-AREF.2
  Bottom 1.27: U$2.7 IC1.32 JP1.9 JP12.9 JP13.9
644P33
  Bottom 1.27: U$2.6 IC1.33 JP1.8 JP12.8 JP13.8
644P34
  Bottom 1.27: U$2.5 IC1.34 JP1.7 JP12.7 JP13.7
644P35
  Bottom 1.27: U$2.4 IC1.35 JP1.6 JP12.6 JP13.6
644P36  (1 unrouted)
  Bottom 1.27: U$2.3 IC1.36 JP1.5 JP12.5 JP13.5
644P37  (1 unrouted)
  Bottom 1.27: U$2.2 IC1.37 JP1.4 JP12.4 JP13.4
644P38  (1 unrouted)
  Bottom 1.27: U$2.1 IC1.38 JP1.3 JP12.3 JP13.3
644P39
  Bottom 1.27: IC1.39 JP1.2 JP12.2 JP13.2
644P40
  Bottom 1.27: IC1.40 JP1.1 JP12.1 JP13.1
AREF  (1 unrouted)
GND  (5 unrouted)
  Bottom 0.254: 55.88,21.34 55.88,5.33
  Bottom 0.305: 7.87,3.94 9.14,3.94 | 43.18,5.59 43.18,22.35
  Bottom 0.406: C1.1 81.92,11.18 76.2,11.18 74.17,9.14 74.17,5.33 73.66,4.83 56.39,4.83 55.88,5.33 | 55.88,21.34 52.83,24.38 644-SJ6-GND.1 45.21,24.38 43.18,22.35 | JP5.2 2.54,39.12 JP5.1 2.79,41.02 0.51,43.31 0.51,46.1 2.29,47.88 45.97,47.88 46.86,46.99 644-SJ8-AGND.1 47.24,47.24 74.42,47.24 | 43.18,5.59 42.42,4.83 23.11,4.83 21.59,6.35 21.59,8.13 20.32,9.4 10.54,9.4 5.97,13.97 SV1.6 | 7.87,3.94 7.49,3.94 7.11,3.56 7.11,1.4 7.75,0.76 83.44,0.76 C5.2 | 9.14,3.94 11.63,3.94 S1.3 S1.4 | Y1.2 81.15,6.86 C2.1 | 92.08,1.91 92.08,1.65 93.22,0.51 97.03,0.51 98.55,2.03 98.55,15.88 97.41,17.02 VR-TOP.GND 97.16,17.02 98.3,18.16 98.3,31.56 U$1.RING 98.42,36.95 98.42,46.1 96.77,47.75 89.92,47.75 86.36,44.2 86.36,44.07 | 86.36,44.07 C4.2 | C7.- 78.23,47.75 82.68,47.75 86.36,44.07
  Bottom 0.813: 92.08,1.91 C6.- 84.58,1.91 | VR-TOP.GND 94.49,14.99 94.49,10.92 92.96,9.4 C1.1 83.69,9.14 C2.1 | C4.2 86.36,43.43 | 74.42,47.24 75.69,47.24 C7.-
  pour Bottom: 0,48.26 1.27,58.42 100.33,58.42 99.06,48.26
MISO  (1 unrouted)
  Bottom 0.406: 6.35,21.59 6.6,21.59 6.99,21.97 6.99,23.11 644-SJ2-MISO.2
  Bottom 0.61: 6.35,21.59 4.95,21.59 SV1.1
MOSI  (1 unrouted)
  Bottom 0.406: 6.86,17.53 7.24,17.53 8.89,19.18 644-SJ3-MOSI.2
  Bottom 0.813: SV1.4 6.86,17.53
N$11  (1 unrouted)
  Top 0.305: U$5.1 12.06,31.11 U$3.16
N$12  (1 unrouted)
  Top 0.305: U$3.15 13.34,29.97 13.97,30.61 13.97,33.02 U$5.2
N$14  (1 unrouted)
  Top 0.305: U$3.5 17.14,18.29 16.51,17.65 16.51,15.24 U$6.5
N$15  (1 unrouted)
  Top 0.305: U$3.1 12.06,18.29 11.43,17.65 11.43,15.24 U$6.1
N$21  (1 unrouted)
  Top 0.305: U$3.14 14.61,31.11 U$5.3
N$22  (1 unrouted)
  Top 0.305: U$5.4 16.51,33.02 16.51,30.73 15.88,30.1 U$3.13
N$23  (1 unrouted)
  Top 0.305: U$3.12 17.14,31.11 U$5.5
N$24  (1 unrouted)
  Top 0.305: U$5.6 19.05,33.02 19.05,30.61 18.41,29.97 U$3.11
N$25  (1 unrouted)
  Top 0.305: U$3.10 19.68,31.11 U$5.7
N$26  (1 unrouted)
  Top 0.305: U$5.8 21.59,33.02 21.59,30.61 20.95,29.97 U$3.9
N$27  (1 unrouted)
  Top 0.305: U$3.8 20.95,17.14 U$6.8
N$28  (1 unrouted)
  Top 0.305: U$3.7 19.68,18.29 19.05,17.65 19.05,15.24 U$6.7
N$29  (1 unrouted)
  Top 0.305: U$3.6 18.41,17.14 U$6.6
N$31  (1 unrouted)
  Top 0.305: U$3.4 15.88,17.14 U$6.4
N$32  (1 unrouted)
  Top 0.305: U$3.3 14.61,18.29 13.97,17.65 13.97,15.24 U$6.3
N$33  (1 unrouted)
  Top 0.305: U$3.2 13.34,17.14 U$6.2
RESET  (1 unrouted)
  Bottom 0.406: 24.13,3.05 41.53,3.05 | R1.1 18.95,8.1 S1.2 S1.1 10.95,8.1 8.13,10.92 4.06,10.92 3.43,11.56 SV1.5 | 42.55,3.05 42.8,3.05 644-SJ13-RESET.1
  Bottom 0.61: R1.1 23.88,3.3 24.13,3.05 | 41.53,3.05 42.55,3.05
RTS#  (1 unrouted)
RXD  (2 unrouted)
  Bottom 0.254: 644-SJ5-RXD.2 57.15,24.77 56.26,25.65 24.64,25.65 22.35,27.94 22.35,45.85 21.46,46.74 20.95,46.74 8.64,46.74 8,46.74 7.49,46.23 7.49,46.1 7.49,40.89
  Bottom 0.305: 2.03,27.94 6.6,27.94
  Bottom 0.406: 2.03,27.94 1.27,28.7 1.27,30.48 JP5.4 | 6.6,27.94 8,29.34 8,40.39 7.49,40.89
SCK  (1 unrouted)
  Bottom 0.406: 4.19,22.99 7.37,26.16 644-SJ1-SCK.2
  Bottom 0.61: 4.19,22.99 1.91,20.7 1.91,19.05 SV1.3
TXD  (3 unrouted)
  Bottom 0.254: 644-SJ4-TXD.2 59.69,25.53 59.05,26.16 24.77,26.16 22.86,28.07 22.86,46.1 22.86,46.74 22.35,47.24 21.08,47.24 8.38,47.24 7.49,47.24 6.99,46.74 6.99,46.23 6.99,40.64
  Bottom 0.406: 6.99,40.64 6.99,40.39 7.37,40.01 7.37,30.73
USB_5V  (1 unrouted)
  Bottom 0.406: 5.33,7.37 8.13,7.37 JP6.1 | JP5.3 1.52,34.29 0.64,33.4 0.64,21.84 0.64,9.14 0.64,9.02 2.29,7.37
  Bottom 0.813: 2.29,7.37 5.33,7.37
VCC  (3 unrouted)
  Bottom 0.406: 10.03,6.35 9.65,6.35 JP6.2 | 9.91,6.6 9.91,8.26 8.76,9.4 3.17,9.4 2.16,10.41 2.16,13.34 | 18.8,6.35 19.05,6.35 19.43,5.97 19.43,5.08 R1.2 22.48,2.03 46.35,2.03 644-SJ7-VCC.1
  Bottom 0.61: 2.16,13.34 2.16,15.62 2.79,16.26 4.45,16.26 4.7,16.51 4.7,18.8 SV1.2 | 644-SJ7-VCC.1 46.61,2.29 | 18.8,6.35 10.03,6.35 10.03,6.48 9.91,6.6
VIN
  Bottom 0.406: 89.15,36.32 89.15,34.81 U$1.TIP
  Bottom 1.27: 89.15,36.32 89.15,43.94 D1.A
VIN_SAFE
  Bottom 0.406: C7.+ 80.9,43.69 C4.1 | D1.C 80.77,43.81 C4.1 | C4.1 84.84,43.31 86.74,41.4 86.74,40.13
  Bottom 0.813: 86.74,40.13 86.74,30.61 89.15,28.19
  Bottom 1.27: 89.15,28.19 91.69,25.65 95.5,25.65 96.52,24.64 VR-TOP.IN
VREG-OUT
  Bottom 0.406: C6.+ 86.87,4.45 C5.1 84.45,4.19 81.66,1.4 9.78,1.4 JP6.3
  Bottom 0.813: C6.+ 90.3,4.45 96.52,10.67
  Bottom 1.27: 96.52,10.67 VR-TOP.OUT
XTAL1  (1 unrouted)
  Bottom 0.406: 56.39,3.05 56.26,3.05 644-SJ11-XTAL1.1
  Bottom 0.61: 56.39,3.05 75.18,3.05 75.69,3.56 75.69,8.89 76.2,9.4 Y1.3 | 644-SJ11-XTAL1.1 55.88,3.43
  Bottom 0.813: Y1.3 C1.2
XTAL2  (1 unrouted)
  Bottom 0.61: Y1.1 77.72,2.79 77.22,2.29 52.45,2.29 644-SJ12-XTAL2.1
  Bottom 0.813: Y1.1 81.15,4.32 C2.2

### Text on the board
tPlace: EXT | USB | GRN | SDA | SCL | PWM | autoreset | enable | A0 | A1 | A2 | A3 | A4 | A5 | A6 | A7 | Aref | GND | 5V | 23 | 22 | 21 | 20 | 19 | 18 | 17 | 16 | 15 | PWM | VIN | ICSP | BLK | 8 | 9 | RX2 | TX2 | PWM | PWM | PWM | 0 | 1 | 2 | 3 | 4 | 5 | 6 | 7 | Reset | 5V | GND | Rx | Tx | 10 | 11 | 12 | 13 | 14 | VIN | SAFE | RESET